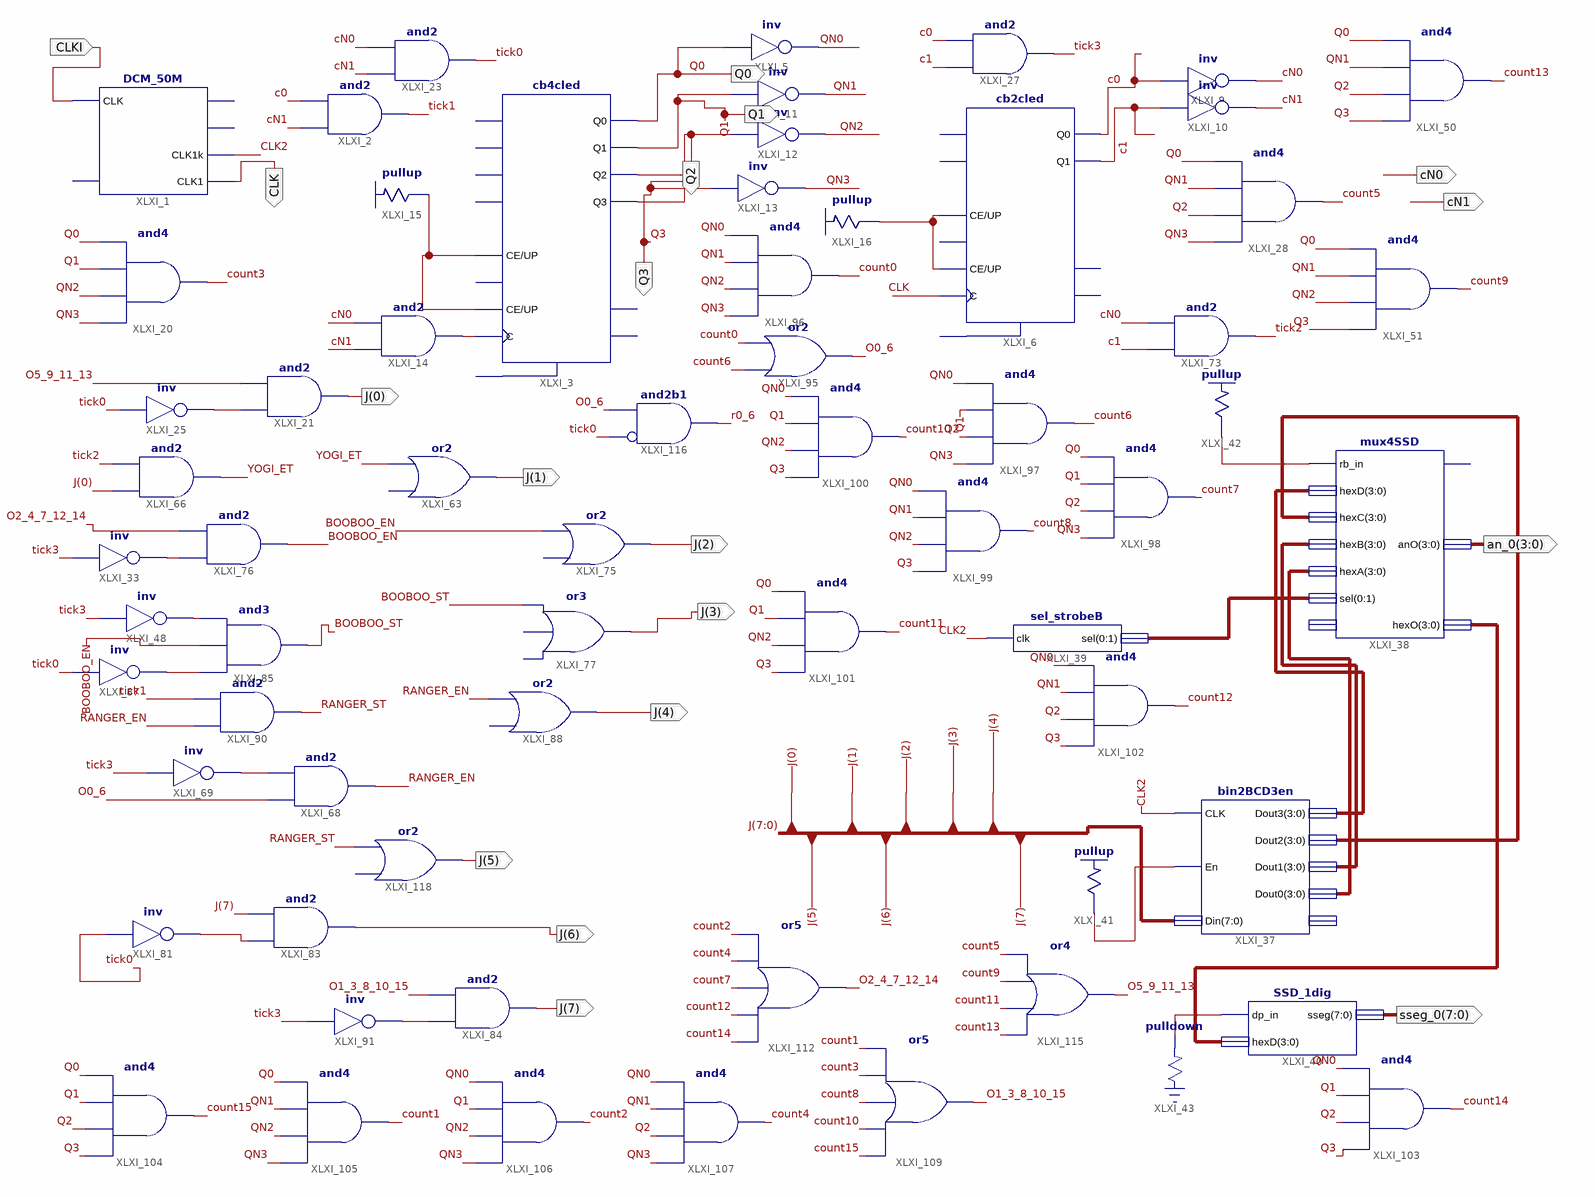
[diagram p0: schematic sheet 1]
// Xilinx ISE schematic Exp4 (1).sch (spartan3e) as structural Verilog: 64 symbols, 18 ports
module \Exp4_(1)  (
  input  CLKI,
  output CLK,
  output Q0,
  output Q2,
  output cN0,
  output cN1,
  output Q1,
  output Q3,
  output [7:0] J,
  output [7:0] sseg_0,
  output [3:0] an_0
);

  wire BOOBOO_EN, BOOBOO_ST, c0, c1, CLK2, count0, count1, count2, count3, count4, count5, count6, count7,
       count8, count9, count10, count11, count12, count13, count14, count15, O0_6, O1_3_8_10_15,
       O2_4_7_12_14, O5_9_11_13, QN0, QN1, QN2, QN3, r0_6, RANGER_EN, RANGER_ST, tick0, tick1, tick2, tick3,
       XLXN_39, XLXN_40, XLXN_42, XLXN_83, XLXN_95, XLXN_158, XLXN_159, XLXN_163, XLXN_210, XLXN_215,
       XLXN_251, XLXN_254, XLXN_264, YOGI_ET;
  wire [1:0] XLXN_226;
  wire [3:0] XLXN_144, XLXN_145, XLXN_146, XLXN_147, XLXN_154;

  DCM_50M XLXI_1 (.CLK(CLKI), .CLK1k(CLK2), .CLK1(CLK));  // open: RST, CLK1M, CLK10k
  and XLXI_2 (tick1, cN1, c0);
  cb4cled XLXI_3 (
    .C(XLXN_39), .CE(XLXN_40), .UP(XLXN_40), .Q0(Q0), .Q1(Q1), .Q2(Q2), .Q3(Q3));  // open: CLR, D0, D1, D2, D3, L, CEO, TC
  not XLXI_5 (QN0, Q0);
  cb2cled XLXI_6 (.C(CLK), .CE(XLXN_42), .UP(XLXN_42), .Q0(c0), .Q1(c1));  // open: CLR, D0, D1, L, CEO, TC
  not XLXI_9 (cN0, c0);
  not XLXI_10 (cN1, c1);
  not XLXI_11 (QN1, Q1);
  not XLXI_12 (QN2, Q2);
  not XLXI_13 (QN3, Q3);
  and XLXI_14 (XLXN_39, cN1, cN0);
  \pullup  XLXI_15 (.O(XLXN_40));
  \pullup  XLXI_16 (.O(XLXN_42));
  and XLXI_20 (count3, QN3, QN2, Q1, Q0);
  and XLXI_23 (tick0, cN1, cN0);
  not XLXI_25 (XLXN_83, tick0);
  and XLXI_27 (tick3, c1, c0);
  and XLXI_28 (count5, QN3, Q2, QN1, Q0);
  not XLXI_33 (XLXN_95, tick3);
  bin2BCD3en XLXI_37 (
    .CLK(CLK2), .En(XLXN_158), .Din(J), .Dout3(XLXN_144), .Dout2(XLXN_145), .Dout1(XLXN_146), .Dout0(XLXN_147));  // open: RBout
  mux4SSD XLXI_38 (
    .rb_in(XLXN_159), .hexD(XLXN_144), .hexC(XLXN_145), .hexB(XLXN_146), .hexA(XLXN_147),
    .sel({XLXN_226[0], XLXN_226[1]}), .anO(an_0), .hexO(XLXN_154));  // open: dp_in, dpO
  sel_strobeB XLXI_39 (.clk(CLK2), .sel({XLXN_226[0], XLXN_226[1]}));
  SSD_1dig XLXI_40 (.dp_in(XLXN_163), .hexD(XLXN_154), .sseg(sseg_0));
  \pullup  XLXI_41 (.O(XLXN_158));
  \pullup  XLXI_42 (.O(XLXN_159));
  \pulldown  XLXI_43 (.O(XLXN_163));
  not XLXI_48 (XLXN_215, tick3);
  and XLXI_50 (count13, Q3, Q2, QN1, Q0);
  and XLXI_51 (count9, Q3, QN2, QN1, Q0);
  and XLXI_21 (J[0], XLXN_83, O5_9_11_13);
  buf XLXI_63 (J[1], YOGI_ET);  // or2 open: I0
  and XLXI_66 (YOGI_ET, J[0], tick2);
  and XLXI_68 (RANGER_EN, O0_6, XLXN_210);
  not XLXI_69 (XLXN_210, tick3);
  and XLXI_73 (tick2, c1, cN0);
  buf XLXI_75 (J[2], BOOBOO_EN);  // or2 open: I0
  and XLXI_76 (BOOBOO_EN, XLXN_95, O2_4_7_12_14);
  buf XLXI_77 (J[3], BOOBOO_ST);  // or3 open: I0, I1
  not XLXI_81 (XLXN_251, tick0);
  and XLXI_83 (J[6], XLXN_251, J[7]);
  and XLXI_84 (J[7], XLXN_264, O1_3_8_10_15);
  and XLXI_85 (BOOBOO_ST, XLXN_254, BOOBOO_EN, XLXN_215);
  not XLXI_87 (XLXN_254, tick0);
  buf XLXI_88 (J[4], RANGER_EN);  // or2 open: I0
  and XLXI_90 (RANGER_ST, RANGER_EN, tick1);
  not XLXI_91 (XLXN_264, tick3);
  or XLXI_95 (O0_6, count6, count0);
  and XLXI_96 (count0, QN3, QN2, QN1, QN0);
  and XLXI_97 (count6, QN3, Q2, Q1, QN0);
  and XLXI_98 (count7, QN3, Q2, Q1, Q0);
  and XLXI_99 (count8, Q3, QN2, QN1, QN0);
  and XLXI_100 (count10, Q3, QN2, Q1, QN0);
  and XLXI_101 (count11, Q3, QN2, Q1, Q0);
  and XLXI_102 (count12, Q3, Q2, QN1, QN0);
  and XLXI_103 (count14, Q3, Q2, Q1, QN0);
  and XLXI_104 (count15, Q3, Q2, Q1, Q0);
  and XLXI_105 (count1, QN3, QN2, QN1, Q0);
  and XLXI_106 (count2, QN3, QN2, Q1, QN0);
  and XLXI_107 (count4, QN3, Q2, QN1, QN0);
  or XLXI_109 (O1_3_8_10_15, count15, count10, count8, count3, count1);
  or XLXI_112 (O2_4_7_12_14, count14, count12, count7, count4, count2);
  or XLXI_115 (O5_9_11_13, count13, count11, count9, count5);
  and XLXI_116 (r0_6, ~tick0, O0_6);  // and2b1
  buf XLXI_118 (J[5], RANGER_ST);  // or2 open: I0
endmodule
